# Altium schematic sheet level_shifter.SchDoc
size A4
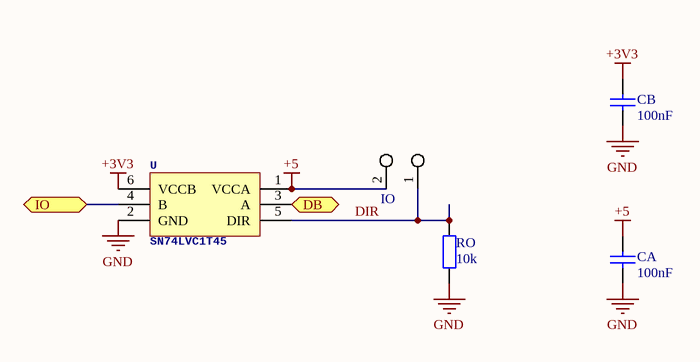
[diagram p0: level_shifter.SchDoc]

## Parts
CA  value 100nF  [CAP 0402/1005 RF]  (hidden comment: Capacitor)
CB  value 100nF  [CAP 0402/1005 RF]  (hidden comment: Capacitor)
IO  Header 1x2  [Header 1x2 100mil Vertical]  (value not drawn)
RO  value 10k  [RES 0402/1005 RF]  (hidden comment: Resistor)
U  SN74LVC1T45  [SOT65P210X110-6N]

## Ports
DB, IO

## Nets
+3V3: CB.2 U.6(VCCB)
+5: CA.2 IO.2 U.1(VCCA)
GND: CA.1 CB.1 RO.2 U.2(GND)
DB: U.3(A) ; port DB
DIR: IO.1 RO.1 U.5(DIR)
IO: U.4(B) ; port IO

## Library data of the parts
CA CB = Capacitor: Capacitor Non-Polarized Generic; Rating: *
IO = Header 1x2: Standard Header Connector
RO = Resistor: Resistor EU Generic
U = SN74LVC1T45: Level Shifter with DIR, Single-Bit, Dual-Supply, Automotive; Mfr: Texas Instruments; Mfr_PN: SN74LVC1T45DCKR; Height: 1.1mm; LCSC: C9382